# Altium schematic sheet SP-3000PCB03.SchDoc
size A3
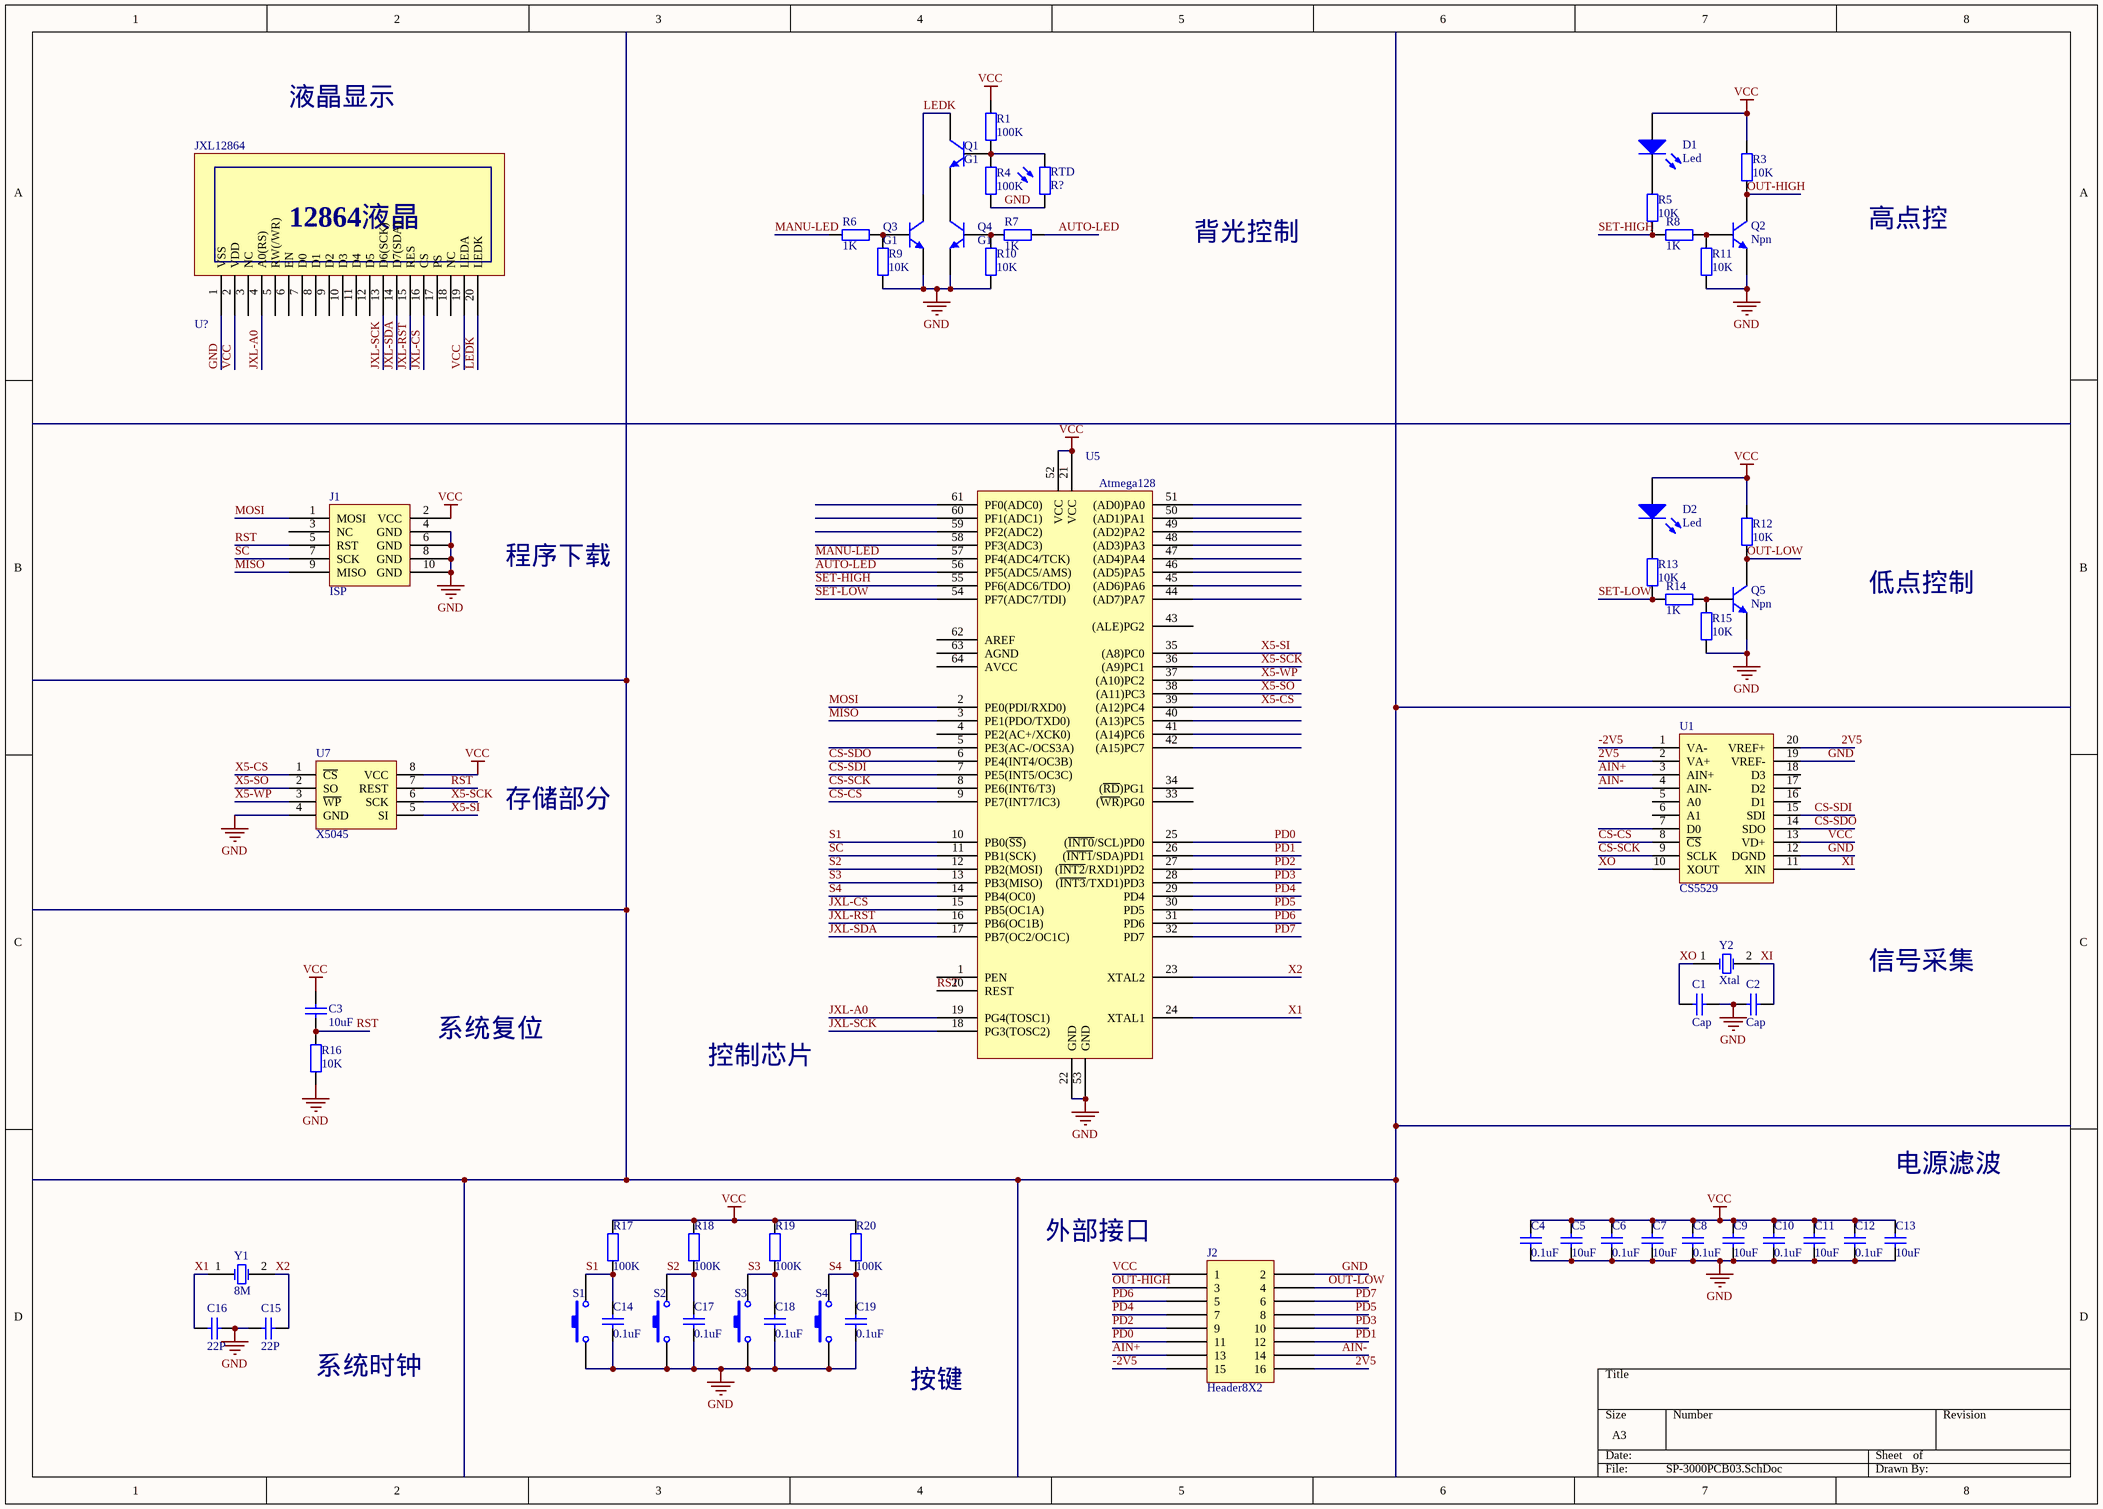
[diagram p0: SP-3000PCB03.SchDoc]

## Parts
C1  Cap  [0805]
C2  Cap  [0805]
C3  10uF  [0805]
C4  0.1uF  [0805]
C5  10uF  [0805]
C6  0.1uF  [0805]
C7  10uF  [0805]
C8  0.1uF  [0805]
C9  10uF  [0805]
C10  0.1uF  [0805]
C11  10uF  [0805]
C12  0.1uF  [0805]
C13  10uF  [0805]
C14  0.1uF  [0805]
C15  22P  [0805]
C16  22P  [0805]
C17  0.1uF  [0805]
C18  0.1uF  [0805]
C19  0.1uF  [0805]
D1  Led  [LED]
D2  Led  [LED]
J1  ISP  [IDC10]
J2  Header8X2  [IDC16]
JXL12864  U?  [JLX12864]
Q1  G1  [9013]
Q2  Npn  [9013]
Q3  G1  [9013]
Q4  G1  [9013]
Q5  Npn  [9013]
R1  100K  [0805]
R3  10K  [0805]
R4  100K  [0805]
R5  10K  [0805]
R6  1K  [0805]
R7  1K  [0805]
R8  1K  [0805]
R9  10K  [0805]
R10  10K  [0805]
R11  10K  [0805]
R12  10K  [0805]
R13  10K  [0805]
R14  1K  [0805]
R15  10K  [0805]
R16  10K  [0805]
R17  100K  [0805]
R18  100K  [0805]
R19  100K  [0805]
R20  100K  [0805]
RTD  R?  [RTD]
S1  (no value)  [SW]
S2  (no value)  [SW]
S3  (no value)  [SW]
S4  (no value)  [SW]
U1  CS5529  [CS5529]
U5  Atmega128  [Quad64]
U7  X5045  [SOP8]
Y1  8M  [CY]
Y2  Xtal  [DIP2(32.768M)]

## Nets
GND: C1.2 C2.1 C4.1 C5.1 C6.1 C7.1 C8.1 C9.1 C10.1 C11.1 C12.1 C13.1 C14.1 C15.1 C16.2 C17.1 C18.1 C19.1 J1.4(GND) J1.6(GND) J1.8(GND) J1.10(GND) J2.2 JXL12864.1(VSS) Q2.2(E) Q3.2(E) Q4.2(E) Q5.2(E) R4.2 R9.1 R10.1 R11.1 R15.1 R16.1 RTD.1 S1.1 S2.1 S3.1 S4.1 U1.12(DGND) U1.19(VREF-) U5.22(GND) U5.53(GND) U7.4(GND)
VCC: C3.2 C4.2 C5.2 C6.2 C7.2 C8.2 C9.2 C10.2 C11.2 C12.2 C13.2 D1.1(A) D2.1(A) J1.2(VCC) J2.1 JXL12864.2(VDD) JXL12864.19(LEDA) R1.1 R3.2 R12.2 R17.2 R18.2 R19.2 R20.2 U1.13(VD+) U5.21(VCC) U5.52(VCC) U7.8(VCC)
2V5: J2.16 U1.2(VA+) U1.20(VREF+)
-2V5: J2.15 U1.1(VA-)
AIN+: J2.13 U1.3(AIN+)
AIN-: J2.14 U1.4(AIN-)
AUTO-LED: R7.1 U5.56(PF5(ADC5/AMS))
CS-CS: U1.8(~{CS}) U5.9(PE7(INT7/IC3))
CS-SCK: U1.9(SCLK) U5.8(PE6(INT6/T3))
CS-SDI: U1.15(SDI) U5.7(PE5(INT5/OC3C))
CS-SDO: U1.14(SDO) U5.6(PE4(INT4/OC3B))
JXL-A0: JXL12864.4(A0(RS)) U5.19(PG4(TOSC1))
JXL-CS: JXL12864.16(CS) U5.15(PB5(OC1A))
JXL-RST: JXL12864.15(RES) U5.16(PB6(OC1B))
JXL-SCK: JXL12864.13(D6(SCK)) U5.18(PG3(TOSC2))
JXL-SDA: JXL12864.14(D7(SDA)) U5.17(PB7(OC2/OC1C))
LEDK: JXL12864.20(LEDK) Q1.3(C) Q3.3(C)
MANU-LED: R6.2 U5.57(PF4(ADC4/TCK))
MISO: J1.9(MISO) U5.3(PE1(PDO/TXD0))
MOSI: J1.1(MOSI) U5.2(PE0(PDI/RXD0))
OUT-HIGH: J2.3 Q2.3(C) R3.1
OUT-LOW: J2.4 Q5.3(C) R12.1
PD0: J2.11 U5.25((~{INT0}/SCL)PD0)
PD1: J2.12 U5.26((~{INT1}/SDA)PD1)
PD2: J2.9 U5.27((~{INT2}/RXD1)PD2)
PD3: J2.10 U5.28((~{INT3}/TXD1)PD3)
PD4: J2.7 U5.29(PD4)
PD5: J2.8 U5.30(PD5)
PD6: J2.5 U5.31(PD6)
PD7: J2.6 U5.32(PD7)
RST: C3.1 J1.5(RST) R16.2 U5.20(REST) U7.7(REST)
S1: C14.2 R17.1 S1.2 U5.10(PB0(~{SS}))
S2: C17.2 R18.1 S2.2 U5.12(PB2(MOSI))
S3: C18.2 R19.1 S3.2 U5.13(PB3(MISO))
S4: C19.2 R20.1 S4.2 U5.14(PB4(OC0))
SC: J1.7(SCK) U5.11(PB1(SCK))
SET-HIGH: R5.1 R8.1 U5.55(PF6(ADC6/TDO))
SET-LOW: R13.1 R14.1 U5.54(PF7(ADC7/TDI))
X1: C16.1 U5.24(XTAL1) Y1.1(OSC1)
X2: C15.2 U5.23(XTAL2) Y1.2(OSC2)
X5-CS: U5.39((A12)PC4) U7.1(~{CS})
X5-SCK: U5.36((A9)PC1) U7.6(SCK)
X5-SI: U5.35((A8)PC0) U7.5(SI)
X5-SO: U5.38((A11)PC3) U7.2(SO)
X5-WP: U5.37((A10)PC2) U7.3(~{WP})
XI: C2.2 U1.11(XIN) Y2.2(OSC2)
XO: C1.1 U1.10(XOUT) Y2.1(OSC1)
NetD1_2: D1.2(K) R5.2
NetD2_2: D2.2(K) R13.2
NetQ1_1: Q1.1(B) R1.2 R4.1 RTD.2
NetQ1_2: Q1.2(E) Q4.3(C)
NetQ2_1: Q2.1(B) R8.2 R11.2
NetQ3_1: Q3.1(B) R6.1 R9.2
NetQ4_1: Q4.1(B) R7.2 R10.2
NetQ5_1: Q5.1(B) R14.2 R15.2

Not connected (* = marked no-connect by the designer): J1 3(NC); JXL12864 3(NC) 5(RW(/WR)) 6(EN) 7(D0) 8(D1) 9(D2) 10(D3) 11(D4) 12(D5) 17(PS) 18(NC); U1 5(A0) 6(A1) 7(D0) 16(D1) 17(D2) 18(D3); U5 1(PEN) 4(PE2(AC+/XCK0)) 5(PE3(AC-/OCS3A)) 33((~{WR})PG0) 34((~{RD})PG1) 40((A13)PC5) 41((A14)PC6) 42((A15)PC7) 43((ALE)PG2) 44((AD7)PA7) 45((AD6)PA6) 46((AD5)PA5) 47((AD4)PA4) 48((AD3)PA3) 49((AD2)PA2) 50((AD1)PA1) 51((AD0)PA0) 58(PF3(ADC3)) 59(PF2(ADC2)) 60(PF1(ADC1)) 61(PF0(ADC0)) 62(AREF) 63(AGND) 64(AVCC)

## Notes on the sheet
- 液晶显示
- 背光控制
- 高点控
- 程序下载
- 低点控制
- 存储部分
- 信号采集
- 系统复位
- 控制芯片
- 电源滤波
- 外部接口
- (near C15) 系统时钟
- 按键
- (in symbol JLX12864) 12864液晶

## Library data of the parts
C1-C19 = Cap: C?
D1 D2 = Led: D?
J1 = isp: U?
J2 = Header8X2: H?
JXL12864 = JLX12864
Q1-Q5 = Npn: Q?
R1 R3-R20 = Res: R?
RTD = 光敏电阻
S1-S4 = Sw-pb: S?
U5 = Atmega128: U?
Y1 Y2 = Xtal: Y?